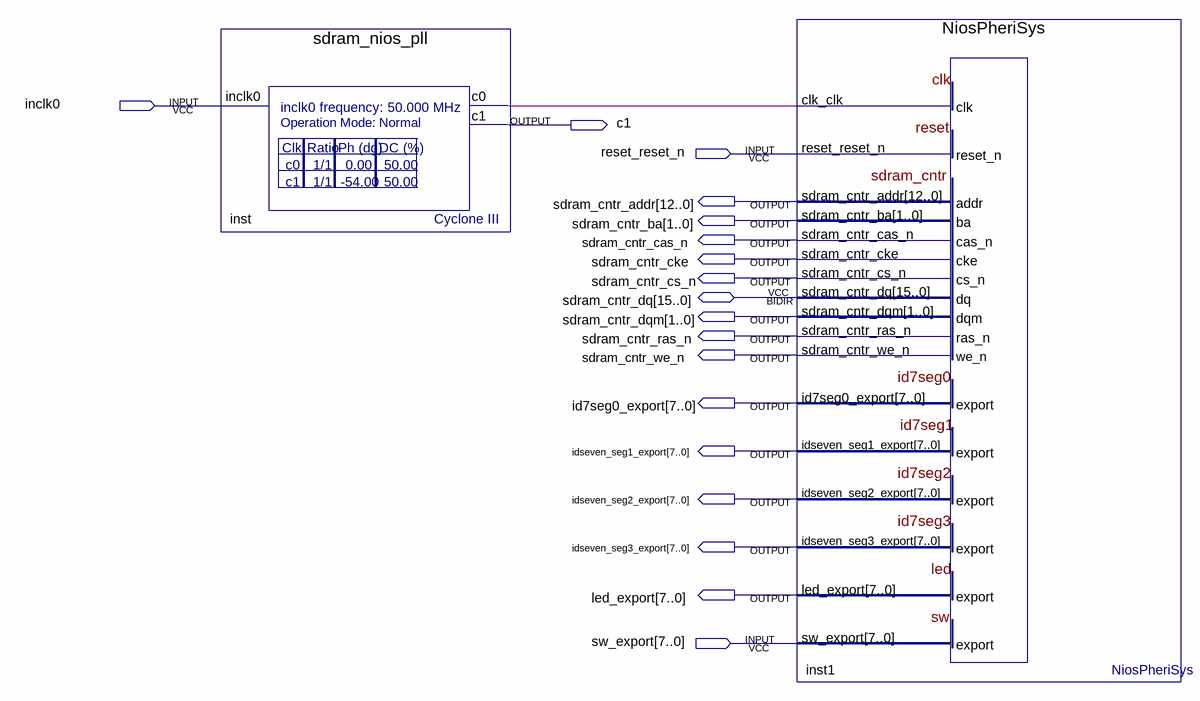
[diagram p0: schematic sheet]
// Quartus schematic NiosPheriSysTop.bdf as structural Verilog: 2 symbols, 18 pins
module NiosPheriSysTop (
  input  inclk0,
  input  reset_reset_n,
  input  [7:0] sw_export,
  inout  [15:0] sdram_cntr_dq,
  output c1,
  output [12:0] sdram_cntr_addr,
  output [1:0] sdram_cntr_ba,
  output sdram_cntr_cas_n,
  output sdram_cntr_cke,
  output sdram_cntr_cs_n,
  output [1:0] sdram_cntr_dqm,
  output sdram_cntr_ras_n,
  output sdram_cntr_we_n,
  output [7:0] id7seg0_export,
  output [7:0] idseven_seg1_export,
  output [7:0] idseven_seg2_export,
  output [7:0] idseven_seg3_export,
  output [7:0] led_export
);

  wire inst_c0;

  sdram_nios_pll inst (.inclk0(inclk0), .c0(inst_c0), .c1(c1));
  NiosPheriSys inst1 (
    .clk_clk(inst_c0), .reset_reset_n(reset_reset_n), .sw_export(sw_export),
    .sdram_cntr_addr(sdram_cntr_addr), .sdram_cntr_ba(sdram_cntr_ba), .sdram_cntr_cas_n(sdram_cntr_cas_n),
    .sdram_cntr_cke(sdram_cntr_cke), .sdram_cntr_cs_n(sdram_cntr_cs_n), .sdram_cntr_dqm(sdram_cntr_dqm),
    .sdram_cntr_ras_n(sdram_cntr_ras_n), .sdram_cntr_we_n(sdram_cntr_we_n), .id7seg0_export(id7seg0_export),
    .idseven_seg1_export(idseven_seg1_export), .idseven_seg2_export(idseven_seg2_export),
    .idseven_seg3_export(idseven_seg3_export), .led_export(led_export), .sdram_cntr_dq(sdram_cntr_dq));
endmodule
